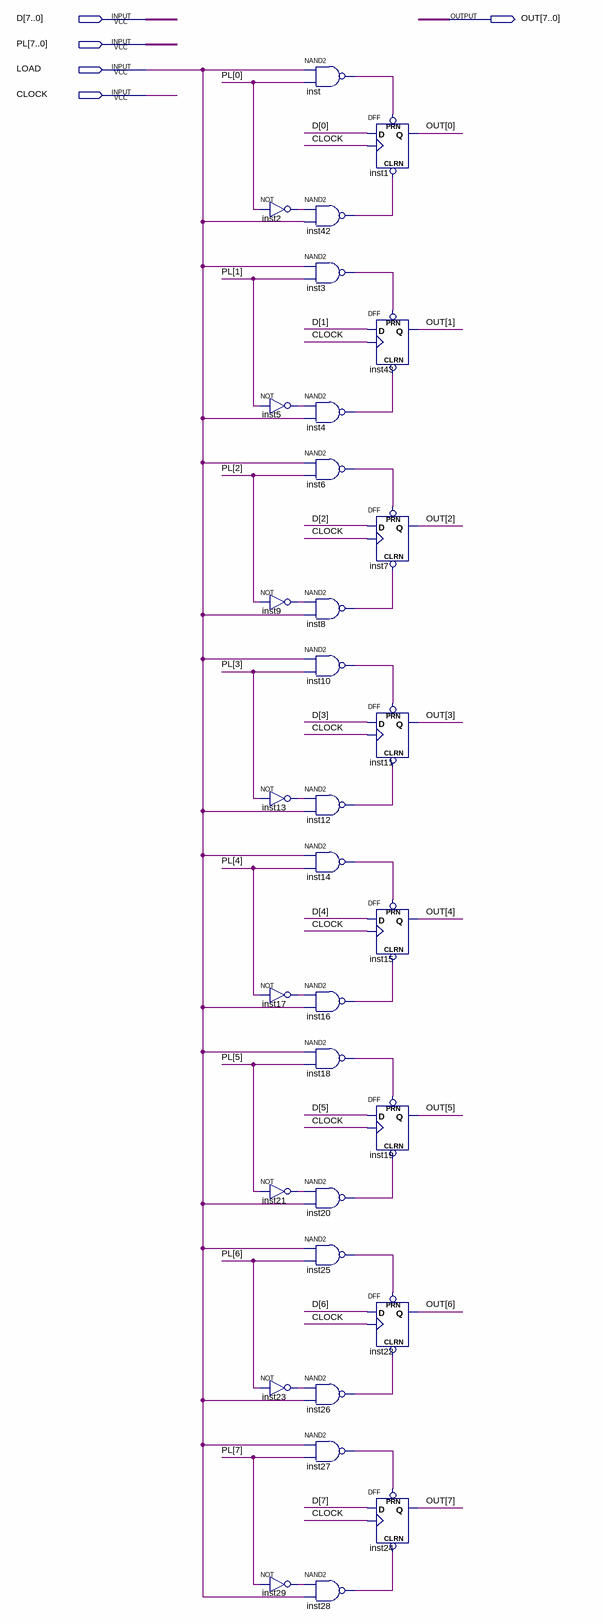
[diagram p0: schematic sheet]
// Quartus schematic register_8bit.bdf as structural Verilog: 32 symbols, 5 pins
module register_8bit (
  input  [7:0] D,
  input  [7:0] PL,
  input  LOAD,
  input  CLOCK,
  output [7:0] OUT
);

  wire inst2_out, inst3_out, inst4_out, inst5_out, inst6_out, inst8_out, inst9_out, inst10_out, inst12_out,
       inst13_out, inst14_out, inst16_out, inst17_out, inst18_out, inst20_out, inst21_out, inst23_out,
       inst25_out, inst26_out, inst27_out, inst28_out, inst29_out, inst42_out, inst_out;

  not inst2 (inst2_out, PL[0]);
  not inst5 (inst5_out, PL[1]);
  not inst9 (inst9_out, PL[2]);
  not inst13 (inst13_out, PL[3]);
  not inst17 (inst17_out, PL[4]);
  not inst21 (inst21_out, PL[5]);
  not inst23 (inst23_out, PL[6]);
  not inst29 (inst29_out, PL[7]);
  nand inst (inst_out, LOAD, PL[0]);
  nand inst42 (inst42_out, inst2_out, LOAD);
  nand inst3 (inst3_out, LOAD, PL[1]);
  nand inst4 (inst4_out, inst5_out, LOAD);
  nand inst6 (inst6_out, LOAD, PL[2]);
  nand inst8 (inst8_out, inst9_out, LOAD);
  nand inst10 (inst10_out, LOAD, PL[3]);
  nand inst12 (inst12_out, inst13_out, LOAD);
  nand inst14 (inst14_out, LOAD, PL[4]);
  nand inst16 (inst16_out, inst17_out, LOAD);
  nand inst18 (inst18_out, LOAD, PL[5]);
  nand inst20 (inst20_out, inst21_out, LOAD);
  nand inst25 (inst25_out, LOAD, PL[6]);
  nand inst26 (inst26_out, inst23_out, LOAD);
  nand inst27 (inst27_out, LOAD, PL[7]);
  nand inst28 (inst28_out, inst29_out, LOAD);
  DFF inst1 (.CLRN(inst42_out), .CLK(CLOCK), .D(D[0]), .PRN(inst_out), .Q(OUT[0]));
  DFF inst43 (.CLRN(inst4_out), .CLK(CLOCK), .D(D[1]), .PRN(inst3_out), .Q(OUT[1]));
  DFF inst7 (.CLRN(inst8_out), .CLK(CLOCK), .D(D[2]), .PRN(inst6_out), .Q(OUT[2]));
  DFF inst11 (.CLRN(inst12_out), .CLK(CLOCK), .D(D[3]), .PRN(inst10_out), .Q(OUT[3]));
  DFF inst15 (.CLRN(inst16_out), .CLK(CLOCK), .D(D[4]), .PRN(inst14_out), .Q(OUT[4]));
  DFF inst19 (.CLRN(inst20_out), .CLK(CLOCK), .D(D[5]), .PRN(inst18_out), .Q(OUT[5]));
  DFF inst22 (.CLRN(inst26_out), .CLK(CLOCK), .D(D[6]), .PRN(inst25_out), .Q(OUT[6]));
  DFF inst24 (.CLRN(inst28_out), .CLK(CLOCK), .D(D[7]), .PRN(inst27_out), .Q(OUT[7]));
endmodule
